# Altium schematic sheet CarteTxMoteur.SchDoc
size A4; PageSetup: Record=PageOptions|CenterHorizontal=True|CenterVertical=True|PrintScale=1.42|XCorrection=1.00|YCorrection=1.00|PrintKind=0|BorderSize=5000000|LeftOffset=0|BottomOffset=0|Orientation=2|PaperLength=1000|PaperWidth=1000|Scale=100|PaperSource=7|PrintQuality=-4|MediaType=1|DitherType=10|PaperKind=A3|PrintScaleMode=1
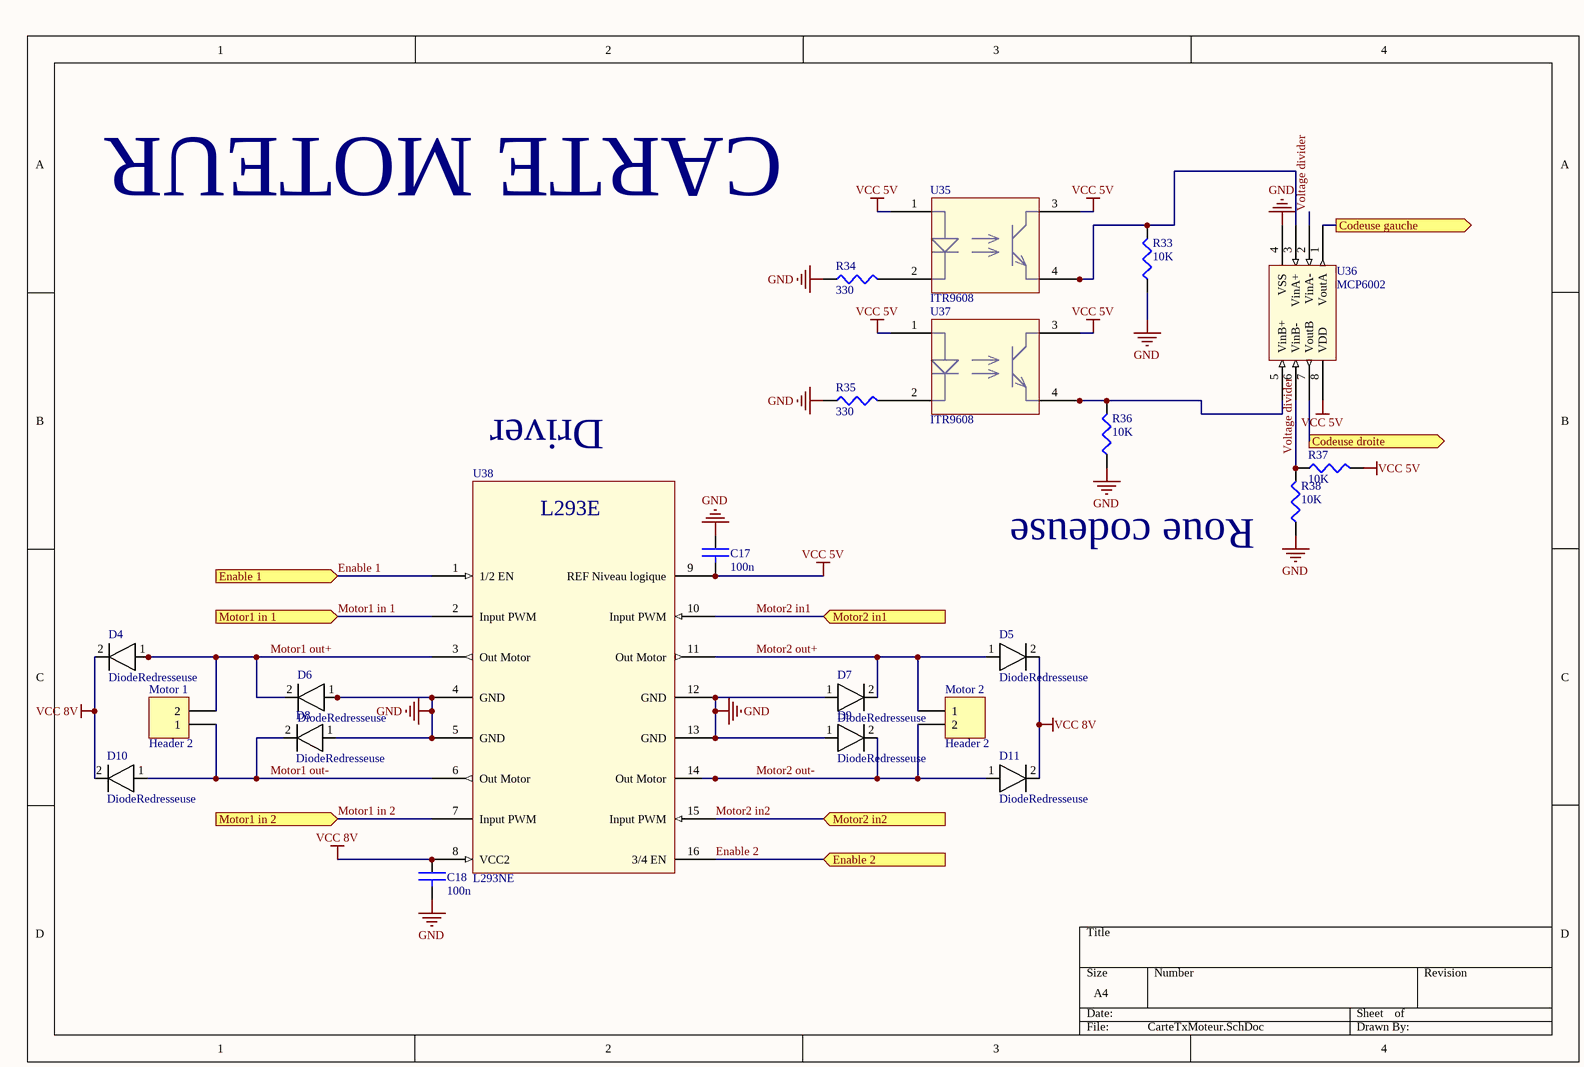
[diagram p0: CarteTxMoteur.SchDoc]

## Parts
C17  value 100n  [0805]  (hidden comment: CAP)
C18  value 100n  [0805]  (hidden comment: CAP)
D4  DiodeRedresseuse  [Diode MULTICOMP SS16]
D5  DiodeRedresseuse  [Diode MULTICOMP SS16]
D6  DiodeRedresseuse  [Diode MULTICOMP SS16]
D7  DiodeRedresseuse  [Diode MULTICOMP SS16]
D8  DiodeRedresseuse  [Diode MULTICOMP SS16]
D9  DiodeRedresseuse  [Diode MULTICOMP SS16]
D10  DiodeRedresseuse  [Diode MULTICOMP SS16]
D11  DiodeRedresseuse  [Diode MULTICOMP SS16]
Motor_1  Header 2  [HDR1X2]
Motor_2  Header 2  [HDR1X2]
R33  value 10K  [0805]  (hidden comment: RES)
R34  value 330  [0805]  (hidden comment: RES)
R35  value 330  [0805]  (hidden comment: RES)
R36  value 10K  [0805]  (hidden comment: RES)
R37  value 10K  [0805]  (hidden comment: RES)
R38  value 10K  [0805]  (hidden comment: RES)
U35  ITR9608  [ITR9608 footprint]
U36  MCP6002  [MCP6002]
U37  ITR9608  [ITR9608 footprint]
U38  L293NE  [L293NE]

## Ports
Codeuse droite (out), Codeuse gauche (out), Enable 1 (in), Enable 2 (in), Motor1 in 1 (in), Motor1 in 2 (in), Motor2 in1 (in), Motor2 in2 (in)

## Nets
GND: C17.1 C18.2 D6.1 D7.1 D8.1 D9.1 R33.1 R34.1 R35.1 R36.1 R38.1 U36.4(VSS) U38.4(GND) U38.5(GND) U38.12(GND) U38.13(GND)
VCC 5V: C17.2 R37.2 U35.1(Ld_Anode) U35.3(Tr_Collector) U36.8(VDD) U37.1(Ld_Anode) U37.3(Tr_Collector) U38.9(REF_Niveau_logique)
VCC 8V: C18.1 D4.2 D5.2 D10.2 D11.2 U38.8(VCC2)
Codeuse droite: U36.7(VoutB) ; port Codeuse droite
Codeuse gauche: U36.1(VoutA) ; port Codeuse gauche
Enable 1: U38.1(1/2_EN) ; port Enable 1
Enable 2: U38.16(3/4_EN) ; port Enable 2
Motor1 in 1: U38.2(Input_PWM) ; port Motor1 in 1
Motor1 in 2: U38.7(Input_PWM) ; port Motor1 in 2
Motor1 out+: D4.1 D6.2 Motor_1.2 U38.3(Out_Motor)
Motor1 out-: D8.2 D10.1 Motor_1.1 U38.6(Out_Motor)
Motor2 in1: U38.10(Input_PWM) ; port Motor2 in1
Motor2 in2: U38.15(Input_PWM) ; port Motor2 in2
Motor2 out+: D5.1 D7.2 Motor_2.1 U38.11(Out_Motor)
Motor2 out-: D9.2 D11.1 Motor_2.2 U38.14(Out_Motor)
Voltage divider: R37.1 R38.2 U36.2(VinA-) U36.6(VinB-)
NetR33_2: R33.2 U35.4(Tr_Emitter) U36.3(VinA+)
NetR34_2: R34.2 U35.2(Ld_Cathode)
NetR35_2: R35.2 U37.2(Ld_Cathode)
NetR36_2: R36.2 U36.5(VinB+) U37.4(Tr_Emitter)

## Notes on the sheet
- CARTE MOTEUR
- Driver
- Roue codeuse
- (in symbol L293NE) L293E

## Library data of the parts
C17 C18 = CAP: capacité non polarisée
Motor_1 Motor_2 = Header 2: Header, 2-Pin; LatestRevisionDate: 17-Jul-2002; LatestRevisionNote: Re-released for DXP Platform.; Publisher: Altium Limited
R33-R38 = RES: resistance
U35 U37 = ITR9608: Intersection sensor
U36 = MCP6002: Double Operational Amplifier